# EAGLE design CUSTOMIZEARDUINO (EAGLE 9.6.2)
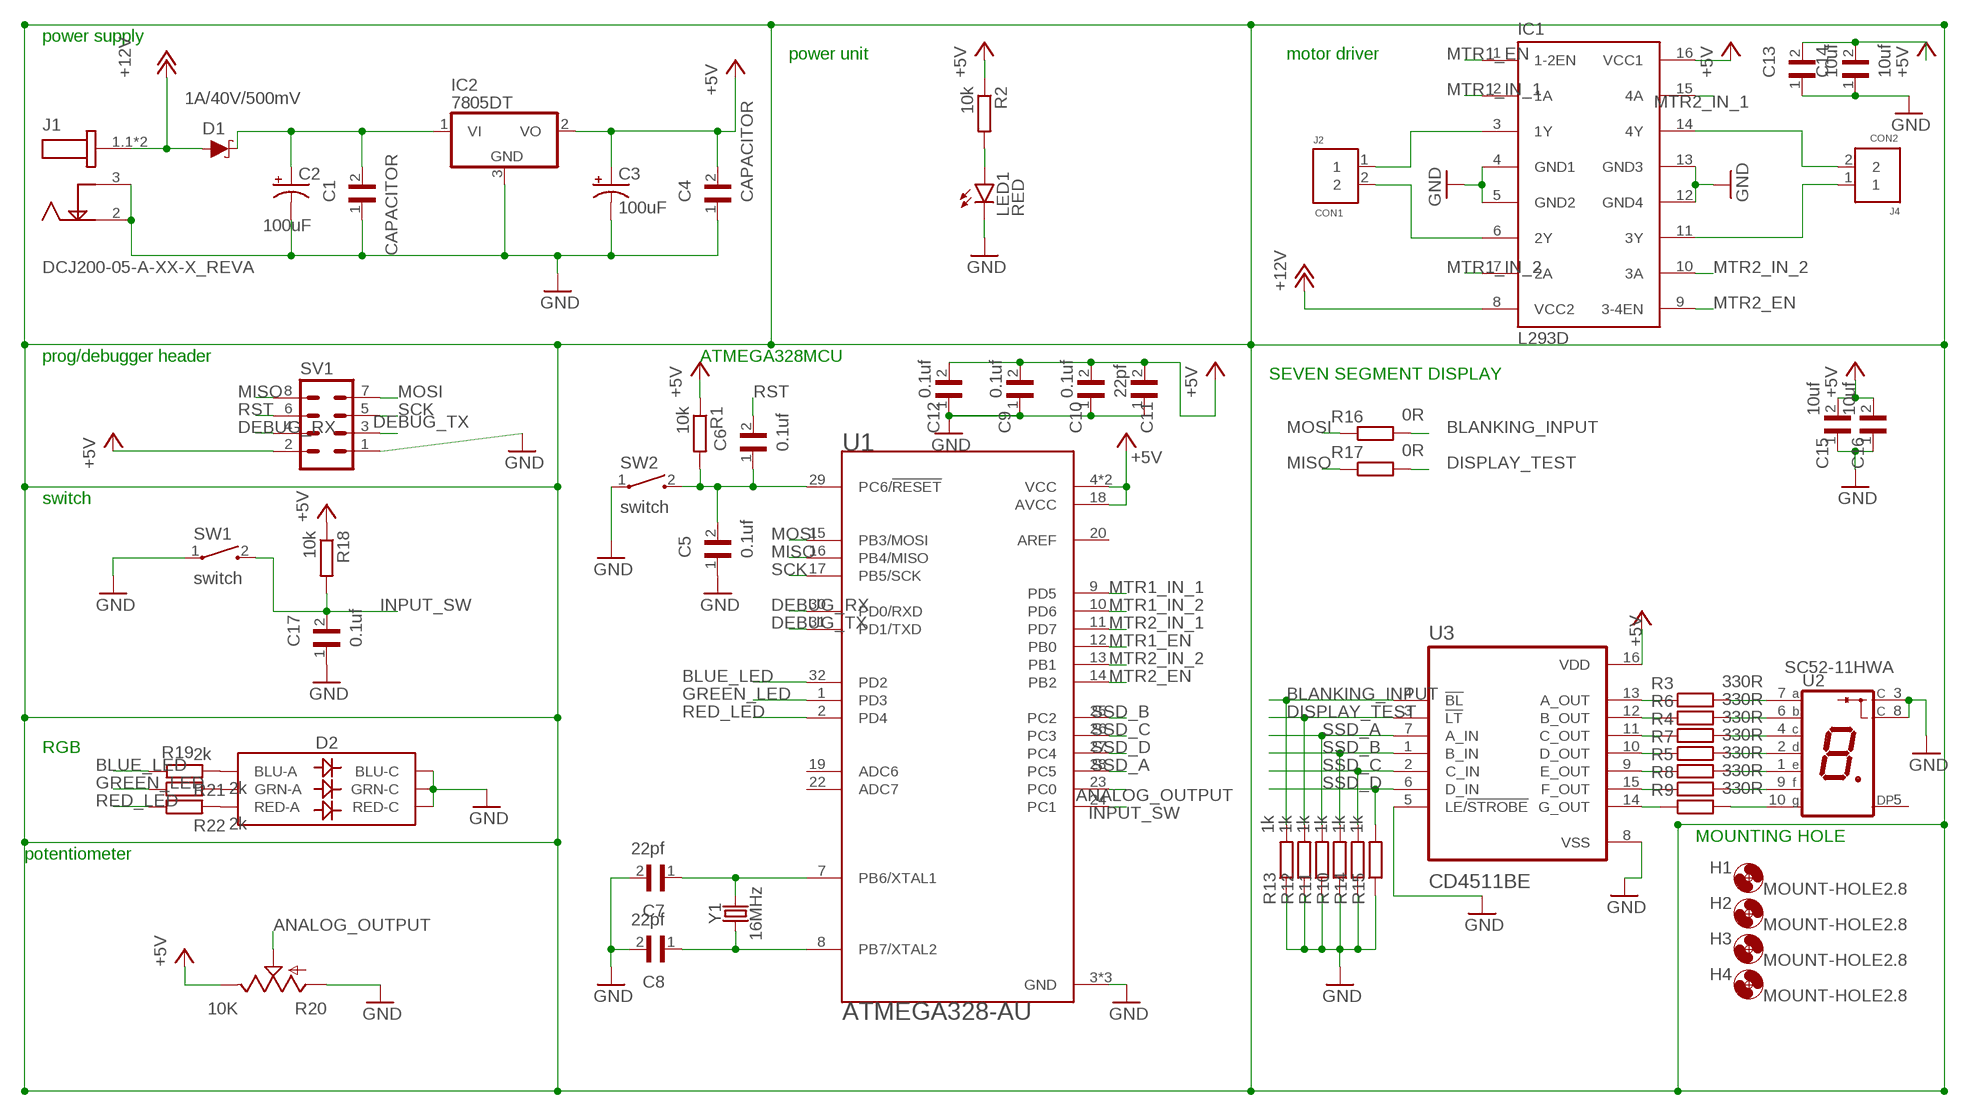
[diagram p0: schematic, sheet 1]

## Parts
C1  CAPACITOR  [C0603]
C2  100uF  100UF-POLAR-RADIAL-2.5MM-25V-20%  [CPOL-RADIAL-2.5MM-6.5MM]
C3  100uF  100UF-POLAR-RADIAL-2.5MM-25V-20%  [CPOL-RADIAL-2.5MM-6.5MM]
C4  CAPACITOR  [C0603]
C5  0.1uf  CAPACITOR  [C0603]
C6  0.1uf  CAPACITOR  [C0603]
C7  22pf  CAPACITOR  [C0603]
C8  22pf  CAPACITOR  [C0603]
C9  0.1uf  CAPACITOR  [C0603]
C10  0.1uf  CAPACITOR  [C0603]
C11  22pf  CAPACITOR  [C0603]
C12  0.1uf  CAPACITOR  [C0603]
C13  10uf  CAPACITOR  [C0603]
C14  10uf  CAPACITOR  [C0603]
C15  10uf  CAPACITOR  [C0603]
C16  10uf  CAPACITOR  [C0603]
C17  0.1uf  CAPACITOR  [C0603]
D1  1A/40V/500mV  DIODE-SCHOTTKY-SS14  [SMA-DIODE]
D2  LED-RGBBRG  [LED-TRICOLOR-5050]
H1  MOUNT-HOLE2.8  [2,8]
H2  MOUNT-HOLE2.8  [2,8]
H3  MOUNT-HOLE2.8  [2,8]
H4  MOUNT-HOLE2.8  [2,8]
IC1  L293D  [DIL16]
IC2  7805DT  [TO252]
J1  DCJ200-05-A-XX-X_REVA  [GCT_DCJ200-05-A-XX-X_REVA]
J2  CON1  282836-2  [CONN_282836-2]
J4  CON2  282836-2  [CONN_282836-2]
LED1  RED  LED  [SMARTLED-TTW]
R1  10k  RESISTOR  [R0603]
R2  10k  RESISTOR  [R0603]
R3  330R  RESISTOR  [R0603]
R4  330R  RESISTOR  [R0603]
R5  330R  RESISTOR  [R0603]
R6  330R  RESISTOR  [R0603]
R7  330R  RESISTOR  [R0603]
R8  330R  RESISTOR  [R0603]
R9  330R  RESISTOR  [R0603]
R10  1k  RESISTOR  [R0603]
R11  1k  RESISTOR  [R0603]
R12  1k  RESISTOR  [R0603]
R13  1k  RESISTOR  [R0603]
R14  1k  RESISTOR  [R0603]
R15  1k  RESISTOR  [R0603]
R16  0R  RESISTOR  [R0603]
R17  0R  RESISTOR  [R0603]
R18  10k  RESISTOR  [R0603]
R19  2k  RESISTOR  [R0603]
R20  10K  TRIM_US-S64W  [S64W]
R21  2k  RESISTOR  [R0603]
R22  2k  RESISTOR  [R0603]
SV1  MA04-2  [MA04-2]
SW1  switch  1437566-3  [SW_1437566-3]
SW2  switch  1437566-3  [SW_1437566-3]
U1  ATMEGA328-AU  [QFP80P900X900X120-32N]
U2  SC52-11HWA  [LED_SC52-11HWA]
U3  CD4511BE  [DIP794W45P254L1969H508Q16]
Y1  16MHz  CRYSTAL-16MHZPTH-HC49US  [HC49US]

## Nets
+5V: C3.1(+) C4.2 C9.2 C10.2 C11.2 C12.2 C13.2 C14.2 C15.2 C16.2 IC1.16(VCC1) IC2.2(VO) R1.1 R2.1 R18.1 R20.E SV1.2 U1.4(VCC) U1.6(VCC) U1.18(AVCC) U3.16(VDD)
+12V: D1.A IC1.8(VCC2) J1.1.1 J1.1.2
ANALOG_OUTPUT: R20.S U1.23(PC0)
BLANKING_INPUT: R13.2 R16.2 U3.4(!BL)
BLUE_LED: D2.6(BLU-A) R19.1 R19.2 U1.32(PD2)
DEBUG_RX: SV1.4 U1.30(PD0/RXD)
DEBUG_TX: SV1.3 U1.31(PD1/TXD)
DISPLAY_TEST: R12.2 R17.2 U3.3(!LT)
GND: C1.1 C2.2(-) C3.2(-) C4.1 C5.1 C7.2 C8.2 C9.1 C10.1 C11.1 C12.1 C13.1 C14.1 C15.1 C16.1 C17.1 D2.1(BLU-C) D2.2(RED-C) D2.3(GRN-C) IC1.4(GND1) IC1.5(GND2) IC1.12(GND4) IC1.13(GND3) IC2.3(GND) J1.2 J1.3 LED1.C@1(C) R10.1 R11.1 R12.1 R13.1 R14.1 R15.1 R20.A SV1.1 SW1.1 SW2.1 U1.3(GND) U1.5(GND) U1.21(GND) U2.3(C) U2.8(C) U3.5(LE/!STROBE) U3.8(VSS)
GREEN_LED: R21.1 U1.1(PD3)
INPUT_SW: C17.2 R18.2 SW1.2 U1.24(PC1)
MISO: R17.1 SV1.8 U1.16(PB4/MISO)
MOSI: R16.1 SV1.7 U1.15(PB3/MOSI)
MTR1_EN: IC1.1(1-2EN) U1.12(PB0)
MTR1_IN_1: IC1.2(1A) U1.9(PD5)
MTR1_IN_2: IC1.7(2A) U1.10(PD6)
MTR2_EN: IC1.9(3-4EN) U1.14(PB2)
MTR2_IN_1: IC1.15(4A) U1.11(PD7)
MTR2_IN_2: IC1.10(3A) U1.13(PB1)
N$2: C1.2 C2.1(+) D1.C IC2.1(VI)
N$3: C5.2 C6.1 R1.2 SW2.2 U1.29(PC6/!RESET)
N$4: C7.1 U1.7(PB6/XTAL1) Y1.2
N$5: C8.1 U1.8(PB7/XTAL2) Y1.1
N$6: LED1.A@1(A) R2.2
N$7: R3.1 U3.13(A_OUT)
N$8: R6.1 U3.12(B_OUT)
N$9: R4.1 U3.11(C_OUT)
N$10: R7.1 U3.10(D_OUT)
N$11: IC1.14(4Y) J4.2
N$12: IC1.11(3Y) J4.1
N$13: IC1.3(1Y) J2.1
N$14: IC1.6(2Y) J2.2
N$15: R5.1 U3.9(E_OUT)
N$16: R8.1 U3.15(F_OUT)
N$17: R9.1 U3.14(G_OUT)
N$18: R3.2 U2.7(A)
N$19: R6.2 U2.6(B)
N$20: R4.2 U2.4(C)
N$21: R7.2 U2.2(D)
N$22: R5.2 U2.1(E)
N$23: R8.2 U2.9(F)
N$24: R9.2 U2.10(G)
N$25: D2.4(GRN-A) R21.2
N$26: D2.5(RED-A) R22.2
RED_LED: R22.1 U1.2(PD4)
RST: C6.2 SV1.6
SCK: SV1.5 U1.17(PB5/SCK)
SSD_A: R11.2 U1.28(PC5) U3.7(A_IN)
SSD_B: R10.2 U1.25(PC2) U3.1(B_IN)
SSD_C: R14.2 U1.26(PC3) U3.2(C_IN)
SSD_D: R15.2 U1.27(PC4) U3.6(D_IN)
Unconnected: U1.19(ADC6) U1.20(AREF) U1.22(ADC7) U2.5(DP)

## Notes on the sheet
- power supply
- power unit | motor driver
- prog/debugger header | ATMEGA328MCU
- SEVEN SEGMENT DISPLAY
- switch
- RGB
- MOUNTING HOLE
- potentiometer

## Library data of the parts
C1 C4-C17 = PC_Capacitor_0603:CAPACITOR: CAP CERAMIC, 0.1UF, 50V, X7R, 0603, FULL REEL Check prices <https://pricing.snapeda.com/parts/CGA3E2X7R1H104K080AA/TDK/view-part?ref=eda>; AVAILABILITY: Good; DESCRIPTION: 0.1µF ±10% 50V Ceramic Capacitor X7R 0603 (1608 Metric); MF: TDK; MP: CGA3E2X7R1H104K080AA; PACKAGE: 1608 TDK; PRICE: None; PURCHASE-URL: https://pricing.snapeda.com/search/part/CGA3E2X7R1H104K080AA/?ref=eda
C2 C3 = SparkFun-Capacitors:100UF-POLAR: 100µF polarized capacitors A capacitor is a passive two-terminal electrical component used to store electrical energy temporarily in an electric field.; PROD_ID: CAP-08439
D1 = SparkFun-DiscreteSemi:DIODE-SCHOTTKY: Schottky diode A Schottky diode is a semiconductor diode which has a low forward voltage drop and a very fast switching action.; PROD_ID: DIO-08053
D2 = SparkFun-LED:LED-RGB: LED-RGB 6 pin RGB LED (no common connector) Packages: PLCC-6 LED-TRICOLOR-5050 - No built-in IC SparkFun Products: Digital Sandbox <https://www.sparkfun.com/products/12651> LED- SMD RGB <https://www.sparkfun.com/products/10866>; PROD_ID: DIO-16048
H1-H4 = holes:MOUNT-HOLE: MOUNTING HOLE with drill center marker
IC1 = st-microelectronics:L293D: PUSH-PULL 4 CHANNEL DRIVER; MPN: L293D; OC_FARNELL: 9589619; OC_NEWARK: 56P8249
IC2 = linear:78*: Positive VOLTAGE REGULATOR Source: http://cache.national.com/ds/LM/LM78L05.pdf http://www.fairchildsemi.com/ds/LM/LM7805.pdf
J1 = PC_CON_DC_Power_Jack:DCJ200-05-A-XX-X_REVA: DC Power Jack, SMT, Horizontal, with Locating Pegs, D2.0mm Check prices <https://pricing.snapeda.com/parts/DCJ200-05-A-K1-A/Global%20Connector%20Technology/view-part?ref=eda>; AVAILABILITY: Warning; DESCRIPTION: Power Barrel Connector Jack 2.05mm ID (0.081), 5.50mm OD (0.217) Surface Mount, Right Angle; MF: Global Connector Technology; MP: DCJ200-05-A-K1-A; PACKAGE: None; PRICE: None; PURCHASE-URL: https://pricing.snapeda.com/search/part/DCJ200-05-A-K1-A/?ref=eda
J2 J4 = PC_CON_ScrewTerminal_2P_5mm:282836-2: TERM BLOCK 2POS SIDE ENTRY 5MM Check availability <https://pricing.snapeda.com/parts/282836-2/TE%20Connectivity/view-part?ref=eda>; AVAILABILITY: In Stock; COMMENT: 282836-2; DESCRIPTION: Connector, Terminal Block; Wire Receptacle; 2 Pos.; 16-30 AWG; 0.197 in. CL; Sid; MF: TE Connectivity; MP: 282836-2; PACKAGE: None; PRICE: None; PURCHASE-URL: https://pricing.snapeda.com/search/part/282836-2/?ref=eda
LED1 = led:LED: LED OSRAM: - CHIPLED LG R971, LG N971, LY N971, LG Q971, LY Q971, LO R971, LY R971 LH N974, LH R974 LS Q976, LO Q976, LY Q976 LO Q996 - Hyper CHIPLED LW Q18S LB Q993, LB Q99A, LB R99A - SideLED LS A670, LO A670, LY A670, LG A670, LP A670 LB A673, LV A673, LT A673, LW A673 LH A674 LY A675 LS A676, LA A676, LO A676, LY A676, LW A676 LS A679, LY A679, LG A679 - Hyper Micro SIDELED® LS Y876, LA Y876, LO Y876, LY Y876 LT Y87S - SmartLED LW L88C, LW L88S LB L89C, LB L89S, LG L890 LS L89K, LO L89K, LY L89K LS L896, LA L896, LO L896, LY L896 - TOPLED LS T670, LO T670, LY T670, LG T670, LP T670 LSG T670, LSP T670, LSY T670, LOP T670, LYG T670 LG T671, LOG T671, LSG T671 LB T673, LV T673, LT T673, LW T673 LH T674 LS T676, LA T676, LO T676, LY T676, LB T676, LH T676, LSB T676, LW T676 LB T67C, LV T67C, LT T67C, LS T67K, LO T67K, LY T67K, LW E67C LS E67B, LA E67B, LO E67B, LY E67B, LB E67C, LV E67C, LT E67C LW T67C LS T679, LY T679, LG T679 LS T770, LO T770, LY T770, LG T770, LP T770 LB T773, LV T773, LT T773, LW T773 LH T774 LS E675, LA E675, LY E675, LS T675 LS T776, LA T776, LO T776, LY T776, LB T776 LHGB T686 LT T68C, LB T68C - Hyper Mini TOPLED® LB M676 - Mini TOPLED Santana® LG M470 LS M47K, LO M47K, LY M47K Source: http://www.osram.convergy.de LUXEON: - LUMILED® LXK2-PW12-R00, LXK2-PW12-S00, LXK2-PW14-U00, LXK2-PW14-V00 LXK2-PM12-R00, LXK2-PM12-S00, LXK2-PM14-U00 LXK2-PE12-Q00, LXK2-PE12-R00, LXK2-PE12-S00, LXK2-PE14-T00, LXK2-PE14-U00 LXK2-PB12-K00, LXK2-PB12-L00, LXK2-PB12-M00, LXK2-PB14-N00, LXK2-PB14-P00, LXK2-PB14-Q00 LXK2-PR12-L00, LXK2-PR12-M00, LXK2-PR14-Q00, LXK2-PR14-R00 LXK2-PD12-Q00, LXK2-PD12-R00, LXK2-PD12-S00 LXK2-PH12-R00, LXK2-PH12-S00 LXK2-PL12-P00, LXK2-PL12-Q00, LXK2-PL12-R00 Source: www.luxeon.com KINGBRIGHT: KA-3528ASYC Source: www.kingbright.com
R1-R19 R21 R22 = PC_Resistor_0603:RESISTOR; MF: Yageo; RESISTOR: 0603
R20 = pot:TRIM_US-: POTENTIOMETER
SV1 = con-lstb:MA04-2: PIN HEADER; OC_FARNELL: unknown; OC_NEWARK: unknown
SW1 SW2 = PC_Switch_1437566-3:1437566-3: Switch Tactile OFF (ON) SPST Rectangular Button Gull Wing 0.05A 12VDC SMD Loose Piece Check prices <https://pricing.snapeda.com/parts/1437566-3/TE%20Connectivity/view-part?ref=eda>; AVAILABILITY: Good; COMMENT: 1437566-3; CONFIGURATION_POLE-THROW: Single Pole - Single Throw; CONTACT_CURRENT_RATING: 50 mA; DESCRIPTION: Tactile Switch SPST-NO Top Actuated Surface Mount; MF: TE Connectivity; MP: 1437566-3; PACKAGE: None; PRICE: None
U1 = PC_IC_ATMEGA328-AU:ATMEGA328-AU: ATmega Series 20 MHz 32 KB Flash 2 KB SRAM 8-Bit Microcontroller - TQFP-32 Check prices <https://pricing.snapeda.com/parts/ATMEGA328-AU/Microchip/view-part?ref=eda>; AVAILABILITY: In Stock; DESCRIPTION: AVR AVR® ATmega Microcontroller IC 8-Bit 20MHz 32KB (16K x 16) FLASH 32-TQFP (7x7); MF: Microchip; MP: ATMEGA328-AU; PACKAGE: TQFP-32 Microchip; PRICE: None; PURCHASE-URL: https://pricing.snapeda.com/search/part/ATMEGA328-AU/?ref=eda
U2 = PC_LED-7-SegmentDisplay:SC52-11HWA: Display: LED; single 7-segment; 13.2mm; red; 0.9-2.2mcd Check availability <https://pricing.snapeda.com/parts/SC52-11HWA/Kingbright/view-part?ref=eda>; AVAILABILITY: Not in stock; DESCRIPTION: Display: LED; single 7-segment; 13.2mm; red; 0.9-2.2mcd; MF: Kingbright; MP: SC52-11HWA; PACKAGE: None; PRICE: None
U3 = PC_IC_CD4511BE:CD4511BE: None Check availability <https://pricing.snapeda.com/parts/CD4511BE/Texas%20Instruments/view-part?ref=eda>; AVAILABILITY: In Stock; DESCRIPTION: CMOS BCD-to-7-Segment LED Latch Decoder Drivers 16-PDIP -55 to 125; MF: Texas Instruments; MP: CD4511BE; PACKAGE: PDIP-16 Texas Instruments; PRICE: None; PURCHASE-URL: https://pricing.snapeda.com/search/part/CD4511BE/?ref=eda
Y1 = SparkFun-Clocks:CRYSTAL-16MHZ: 16MHz Crystal Digikey Example <http://www.digikey.com/product-search/en?keywords=535-9122-1-ND> Frequency: 16MHz Frequency Stability: ±50ppm Frequency Tolerance: ±20ppm Load Capacitance: 18pF SparkFun Products: Pro Micro -5V/16MHz <https://www.sparkfun.com/products/12640> SparkFun Serial Enabled LCD Kit <https://www.sparkfun.com/products/10097>; PROD_ID: XTAL-08181; SF_ID: COM-00536

## Board
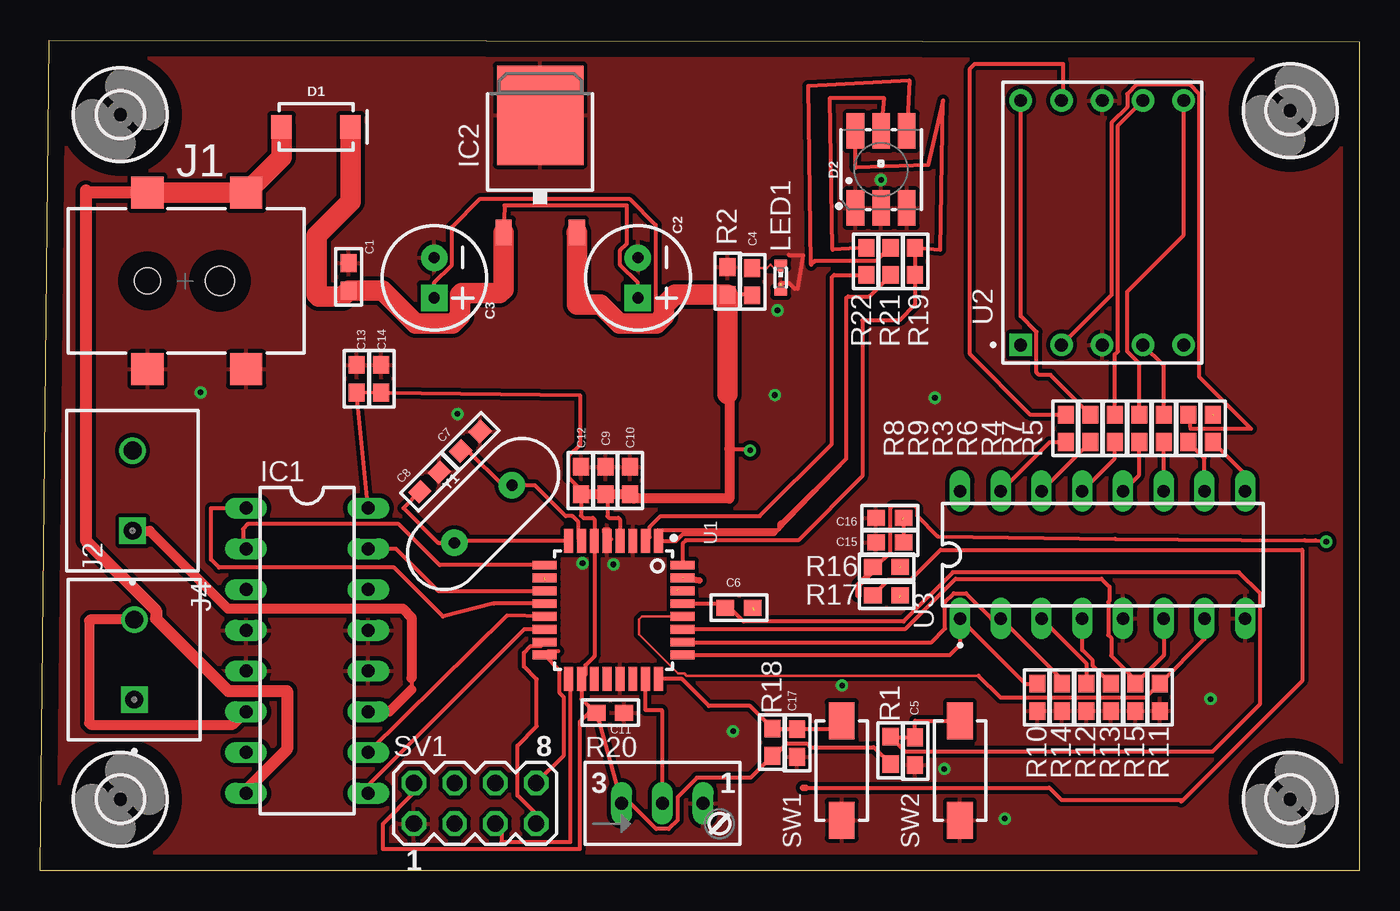
[diagram p1: board, top side]
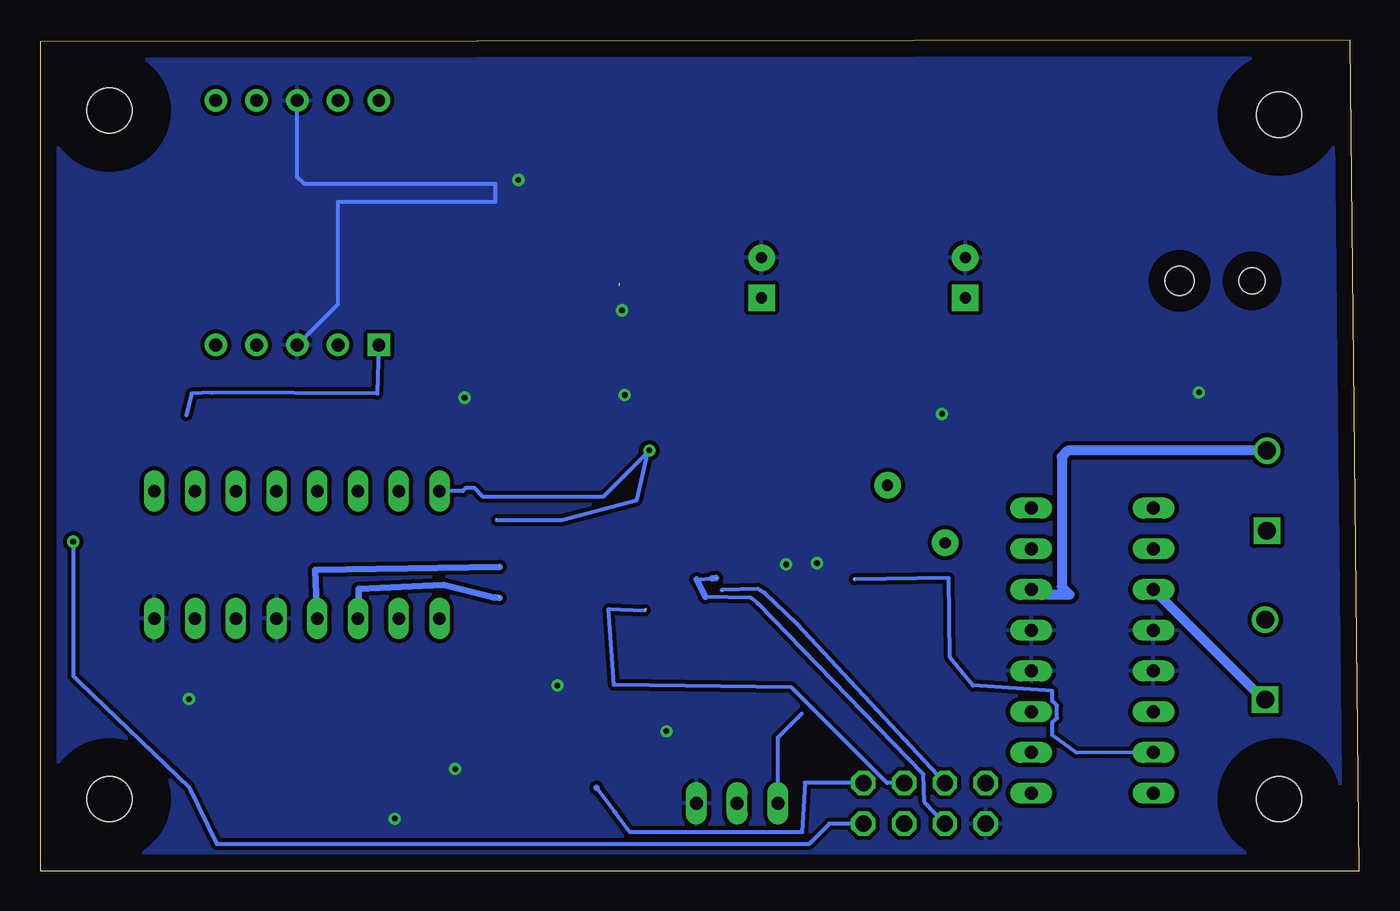
[diagram p2: board, bottom side, seen from below]

Size 82.22 x 51.77 mm. Coordinates in mm from the lower left corner, seen from the top.
Outline: 0.56,51.77 82.22,51.66 82.22,0 0,0 0.56,51.77
Copper layers (1*16): Top 0.035mm / dielectric 1.5mm / Bottom 0.035mm
Design rules "default": minimum track width 6mil, minimum drill 0.35mm, track to track 6mil, track to pad 6mil, pad to pad 6mil, via to via 6mil, smd to smd 6mil, copper to edge 40mil, drill to drill 6mil, minimum pad ring 10mil, minimum via ring 8mil, stop-mask expansion 4mil, vias tented up to drill 0mil, thermal gap 10mil

### Footprints (pad centres in the part's own frame; a part is rotated, then mirrored left to right if it is on the bottom)
C0603 = smd 1.1 x 1: 1 -0.909,0; 2 0.809,0
CPOL-RADIAL-2.5MM-6.5MM = drill 0.7 pad 1.651 square: 1 1.25,0 | drill 0.7 pad 1.651: 2 -1.25,0
SMA-DIODE = smd 1.27 x 1.47: A -2.15,0; C 2.15,0
LED-TRICOLOR-5050 = smd 2.2 x 1.1: 1 -2.4,1.6; 2 -2.4,0; 3 -2.4,-1.6; 4 2.4,-1.6; 5 2.4,0; 6 2.4,1.6
2,8 = hole 2.8: 0,0
DIL16 = drill 0.813 long: 1 -8.89,-3.81; 2 -6.35,-3.81; 3 -3.81,-3.81; 4 -1.27,-3.81; 5 1.27,-3.81; 6 3.81,-3.81; 7 6.35,-3.81; 8 8.89,-3.81; 9 8.89,3.81; 10 6.35,3.81; 11 3.81,3.81; 12 1.27,3.81; 13 -1.27,3.81; 14 -3.81,3.81; 15 -6.35,3.81; 16 -8.89,3.81
TO252 = smd 1 x 1.6: 1 -2.28,-4.8; 2 2.28,-4.8 | smd 5.4 x 6.2: 3 0,2.5
GCT_DCJ200-05-A-XX-X_REVA = smd 2 x 2: 1.1 -5.5,3.8; 1.2 -5.5,-2.35; 2 5.5,-2.35; 3 5.5,3.8 | hole 1.8: 0,2.15 | hole 1.6: 0,-2.35
CONN_282836-2 = drill 1.1 square: 1 -2.5,0 | drill 1.1: 2 2.5,0
SMARTLED-TTW = smd 0.8 x 0.5: A 0,-0.875; C 0,0.875 | smd 0.35 x 0.35: A@1 0,-0.5; C@1 0,0.5
R0603 = smd 1.1 x 1: 1 -0.85,0; 2 0.85,0
S64W = drill 0.813 long: A 2.54,1.27; E -2.54,1.27; S 0,1.27
MA04-2 = drill 1.016 octagon: 1 -3.81,-1.27; 2 -3.81,1.27; 3 -1.27,-1.27; 4 -1.27,1.27; 5 1.27,-1.27; 6 1.27,1.27; 7 3.81,-1.27; 8 3.81,1.27
SW_1437566-3 = smd 2.3 x 1.6: 1 -3.08,0; 2 3.12,0
QFP80P900X900X120-32N = smd 1.5 x 0.55: 1 -4.3,2.8; 2 -4.3,2; 3 -4.3,1.2; 4 -4.3,0.4; 5 -4.3,-0.4; 6 -4.3,-1.2; 7 -4.3,-2; 8 -4.3,-2.8; 17 4.3,-2.8; 18 4.3,-2; 19 4.3,-1.2; 20 4.3,-0.4; 21 4.3,0.4; 22 4.3,1.2; 23 4.3,2; 24 4.3,2.8 | smd 0.55 x 1.5: 9 -2.8,-4.3; 10 -2,-4.3; 11 -1.2,-4.3; 12 -0.4,-4.3; 13 0.4,-4.3; 14 1.2,-4.3; 15 2,-4.3; 16 2.8,-4.3; 25 2.8,4.3; 26 2,4.3; 27 1.2,4.3; 28 0.4,4.3; 29 -0.4,4.3; 30 -1.2,4.3; 31 -2,4.3; 32 -2.8,4.3
LED_SC52-11HWA = drill 0.8 pad 1.4 square: 1 -7.62,5.08 | drill 0.8 pad 1.4: 2 -7.62,2.54; 3 -7.62,0; 4 -7.62,-2.54; 5 -7.62,-5.08; 6 7.62,-5.08; 7 7.62,-2.54; 8 7.62,0; 9 7.62,2.54; 10 7.62,5.08
DIP794W45P254L1969H508Q16 = drill 0.78 pad 1.13 long: 1 -3.97,8.89; 2 -3.97,6.35; 3 -3.97,3.81; 4 -3.97,1.27; 5 -3.97,-1.27; 6 -3.97,-3.81; 7 -3.97,-6.35; 8 -3.97,-8.89; 9 3.97,-8.89; 10 3.97,-6.35; 11 3.97,-3.81; 12 3.97,-1.27; 13 3.97,1.27; 14 3.97,3.81; 15 3.97,6.35; 16 3.97,8.89
HC49US = drill 0.7 pad 1.651: 1 -2.54,0; 2 2.54,0

### Placement (x,y rotation side)
C1  19.23,36.96 270 top
C2  37.26,36.96 270 top
C3  24.56,36.96 270 top
C4  42.85,36.7 270 top
C5  54.53,7.49 90 top
C6  43.61,16.38 0 top
C7  26.85,26.8 45 top
C8  24.31,24.26 45 top
C9  35.23,24.26 270 top
C10  36.75,24.26 270 top
C11  35.48,9.84 180 top
C12  33.71,24.26 270 top
C13  19.74,30.61 270 top
C14  21.26,30.61 270 top
C15  53.01,20.45 0 top
C16  53.01,21.97 0 top
C17  47.17,8 90 top
D1  17.2,46.36 0 top
D2  52.41,43.7 90 top
H1  77.9,47.37 0 top
H2  5,4.45 0 top
H3  77.9,4.45 0 top
H4  5,47.12 0 top
IC1  16.64,13.71 270 top
IC2  31.17,44.58 0 top
J1  9.04,36.75 270 top
J2  5.87,13.15 90 top
J4  5.77,23.68 90 top
LED1  46.15,36.96 180 top
R1  53.01,7.49 90 top
R2  44.37,36.7 90 top
R3  66.98,27.56 90 top
R4  70.03,27.56 90 top
R5  73.08,27.56 90 top
R6  68.5,27.56 90 top
R7  71.55,27.56 90 top
R8  63.93,27.56 90 top
R9  65.46,27.56 90 top
R10  62.15,10.79 90 top
R11  69.77,10.79 90 top
R12  65.2,10.79 90 top
R13  66.73,10.79 90 top
R14  63.68,10.79 90 top
R15  68.25,10.79 90 top
R16  52.76,18.92 0 top
R17  52.76,17.14 0 top
R18  45.64,8 90 top
R19  54.53,37.97 90 top
R20  38.79,2.92 0 top
R21  53.01,37.97 90 top
R22  51.49,37.97 90 top
SV1  27.1,4.19 0 top
SW1  49.96,6.22 90 top
SW2  57.33,6.22 90 top
U1  35.74,16.24 270 top
U2  66.19,40.38 90 top
U3  66.22,19.68 90 top
Y1  27.61,22.22 45 top

### Tracks (layer width: path | path; a pad name or v marks a point on that pad's centre or on a via)
+5V  (via drill 0.35)  (1 unrouted)
  Top 0.254: C4.2 44.33,35.89 R2.1 | C9.2 35.35,23.33 35.35,22.09 35.45,21.99 36.05,21.99 36.14,21.9 U1.4 | 34.6,9.84 C11.2 R20.E 36.8,4.19 38.4,2.59 39.17,2.59 39.73,3.14 39.73,4.58 40.94,5.79 44.28,5.79 R18.1 45.78,7.15 46.55,7.92 47.78,7.92 48.02,7.69 51.96,7.69 R1.1 | 34.6,9.84 33.74,10.7 U1.18 33.98,12.18 33.98,12.8 34.54,13.36 U1.6 34.54,21.9 34.45,21.99 33.85,21.99 33.71,22.13 C12.2 33.71,23.72 32.93,24.5 32.93,25.83 33.63,26.54 33.63,29.64 C14.2 19.74,29.77 | SV1.2 23.29,4.83 21.35,2.89 21.35,1.34 33.65,1.34 33.65,9.29 34.2,9.84 34.6,9.84 | 42.95,26.29 44.15,26.29 v44.25,26.19 | IC1.16 19.74,29.77 | 19.74,29.77 C13.2 | C16.2 54.24,22.16 | C3.1 24.56,36.64 25.67,37.75 25.67,40.11 27.43,41.88 27.44,41.87 36.73,41.87 38.37,40.23 38.37,34.77 38.2,34.6 36.32,34.6 35.63,35.29 33.45,35.29 | C16.2 54.24,22 | C16.2 C15.2
  Top 0.635: 42.85,29.69 42.95,29.59 42.95,26.29 42.95,23.19 37.01,23.19 C10.2 C9.2 C12.2
  Top 1.27: IC2.2 33.45,35.29 34.91,35.29 36.11,34.09 38.41,34.09 38.87,34.55 38.87,35.22 39.55,35.89 C4.2 42.85,29.69
  Bottom 0.254: R20.E 36.25,8.29 34.75,9.79 | v44.25,26.19 44.34,26.1 | 44.34,26.1 47.15,23.29 54.6,23.29 55.16,23.84 55.7,23.84 55.89,23.65 U3.16 | 53.75,21.84 49.73,21.84 45.03,23.1 44.34,26.1
+12V
  Top 0.762: J1.1.2 2.98,42.25 2.85,42.39 2.85,20.59 7.22,16.21 7.22,15.7 11.73,11.19 15.39,11.19 15.39,7.56 12.83,5.01 IC1.8
  Top 1.27: J1.1.2 J1.1.1 15.05,44.46 D1.A
ANALOG_OUTPUT
  Top 0.254: R20.S 38.79,9.95 38.75,9.99 37.75,9.99 37.74,10 U1.23
BLANKING_INPUT  (1 unrouted)
  Top 0.254: R13.2 65.61,12.76 65.61,13.09 64.95,13.75 U3.4
  Bottom 0.406: U3.4 65.07,18.74 53.58,18.91
BLUE_LED
  Top 0.254: R19.1 | R19.1 54.53,35.28 53.55,34.29 51.25,34.29 51.25,24.59 47.25,20.59 40.25,20.59 40.04,20.38 U1.32 | R19.1 R19.2 56.1,38.69 56.27,48 55.34,43.97 50.82,43.8 D2.6
DEBUG_RX  (1 unrouted)
  Top 0.254: U1.30 39.67,17.44
  Bottom 0.254: SV1.4 35.04,15.39 37.07,17.32 37.49,17.57 39.75,17.48
DEBUG_TX  (1 unrouted)
  Top 0.406: U1.31 41.09,18.07
  Bottom 0.254: SV1.3 27.1,4.24 27.18,6 37.49,16.65 37.91,16.98 40.76,17.07 | 41.3,18.15 41.26,18.16 40.33,18.22
  Bottom 0.406: 40.76,17.07 41.3,18.15 | 40.09,18.24 40.33,18.22
DISPLAY_TEST  (1 unrouted)
  Top 0.254: U3.3 65.2,12.92 R12.2
  Bottom 0.406: U3.3 62.38,17.57 57.08,17.81 53.95,17.03 53.78,17.03 53.58,16.98
GND  (via drill 0.35)  (1 unrouted)
  Top 0.152: C4.1 42.94,37.61
  Top 0.254: J1.3 13.1,31.52 | 35.58,20.65 35.27,20.97 | 35.27,20.97 35.15,21.09 35.15,21.29 35.45,21.29 | C11.1 36.14,10.1 | R11.1 69.67,10.04 | 57.3,3.14 57.35,3.19 SW2.1 | 20.3,12.59 IC1.12 | SW1.1 49.55,3.56 | R10.1 62.15,10.04 | 42.94,37.61 42.99,37.61 | 46.65,38.38 46.67,38.36 47.55,38.36 47.21,36.26 47.02,36.26 46.67,36.61 46.15,36.61 | 35.27,20.97 35.29,20.85 U1.5
  Bottom 0.254: U2.3 63.65,35.3 63.65,41.69 53.85,41.69 53.85,42.79 65.75,42.79 66.19,43.23 U2.8
  other vias: 43.19,8.68 45.79,29.64 26.01,28.47 33.8,19.16 52.41,43.05 60.12,3.24 45.96,34.92 55.76,29.47 72.95,10.7 56.35,6.34 49.98,11.53 35.73,19.08 10,29.81
  pour Top (isolate 0.254): -1.82,53.86 84.26,53.78 84.35,-2.63 -2.58,-2.63
  pour Bottom (isolate 0.254): -1.23,54.03 84.51,53.86 84.76,-2.46 -1.57,-2.55
GREEN_LED
  Top 0.254: 53.15,36.98 R21.1 51.68,35.79 50.35,35.79 50.25,35.69 50.25,25.69 | 50.25,25.69 46.25,21.69 46.15,21.69 46.05,21.59 46.05,21.29 45.95,21.19 | 45.95,21.19 38.45,21.19 | U1.1 39.62,20.54 40.08,21 45.75,21 45.95,21.19 | 45.95,21.19 50.25,25.69
INPUT_SW
  Top 0.254: SW1.2 49.43,8.81 C17.2 45.68,8.81 R18.2 44.24,10.25 41.69,10.25 40,11.94 U1.24
MISO  (1 unrouted)
  Top 0.254: SV1.8 32.65,7.2 32.65,10.81 32.38,11.07 32.38,12.49 U1.16 31.68,13.68 32.3,13.68 32.31,13.69 | R17.1 52.9,18.14 54.27,18.14 56.12,19.99 78.65,19.99 78.65,11.81 71.22,4.38 | 71.22,4.38 71.12,4.29 | 71.22,4.38 63.67,4.38 62.89,5.16 47.72,5.16 | 47.55,5.16
  Top 0.406: 47.55,5.16 47.72,5.16
  Bottom 0.254: 34.57,5.49 34.54,5.46 | SV1.8 34.54,5.46 | 34.54,5.46 34.72,2.4 45.45,2.4 46.36,3.61 46.44,3.69 47.55,5.16
  Bottom 0.406: 47.55,5.16
MOSI  (via drill 0.35)
  Top 0.254: SV1.7 30.91,3.53 29.75,4.69 29.75,7.79 30.95,8.99 30.95,11.93 30.16,12.72 30.16,13.58 30.57,13.99 31.19,13.99 U1.15 | R16.1 52.07,18.92 52.99,19.84 52.99,22.59 53.15,22.75 54.48,22.75 54.65,22.59 54.65,22.12 55.93,20.84 66.99,20.67 78.81,20.59 | 78.81,20.59 79.48,20.59 v80.15,20.5 78.81,20.59
  Top 0.406: 51,17.15 51,17.79 51.91,18.7 R16.1
  Bottom 0.254: SV1.7 33.03,2.92 34.3,1.64 71.19,1.64 72.91,5.16 79.73,11.71 80.15,12.12 v80.15,20.5
MTR1_EN
  Top 0.254: IC1.1 10.66,22.6 10.65,22.59 10.65,19.39 11.15,18.89 22.05,18.89 25.1,15.84 28.27,16.65 U1.12
MTR1_IN_1
  Top 0.254: U1.9 24.9,19.04 22.35,21.59 12.95,21.59 12.65,21.29 12.65,20.24 IC1.2
MTR1_IN_2  (1 unrouted)
  Bottom 0.254: IC1.7 17.62,7.34 19.13,8.43 19.13,9.22 18.85,9.51 18.85,10.29 19.13,10.57 19.13,11.2 24.08,11.53 25.5,13.29 25.59,18.24 31.46,18.16
MTR2_EN
  Top 0.254: U1.14 30.17,15.04 20.45,5.32 IC1.9
MTR2_IN_1
  Top 0.254: IC1.15 22.18,20.06 24.8,17.44 U1.11
MTR2_IN_2
  Top 0.254: U1.13 29.11,15.89 IC1.10
  Bottom 0.254: IC1.10 20.85,7.36
N$2
  Top 0.254: C2.1 37.26,36.64 36.16,37.75 36.16,38.67 36.57,39.08 36.57,41.46 28.94,41.46 IC2.1
  Top 1.27: D1.C 19.35,41.69 17.25,39.59 17.25,35.89 17.35,35.79 18.87,35.79 C1.2 21.36,36.15 23.41,34.09 25.71,34.09 26.17,34.55 26.17,35.89 | 26.17,35.89 26.55,35.89 | 26.17,35.89 26.27,35.99 28.65,35.99 28.89,36.23 IC2.1
N$3
  Top 0.254: U1.29 42.45,16.64 42.57,16.51 | 42.57,16.51 C6.1 | SW2.2 54.53,9.34 C5.2 53.05,8.3 R1.2 53.94,7.42 73.05,7.42 76.03,10.4 76.03,17.28 74.72,18.59 56.88,18.59 53.8,15.52 43.84,15.52 42.84,16.51 42.57,16.51
N$4
  Top 0.254: U1.7 33.55,20.73 33.55,21.71 33.17,22.09 32.75,22.09 30.82,24.02 Y1.2 28.82,24.02 26.68,26.15 C7.1
N$5
  Top 0.254: U1.8 25.92,20.54 Y1.1 24.81,20.43 22.65,22.59 22.65,22.6 C8.1
N$6
  Top 0.152: R2.2 45.31,37.55 45.52,37.77 45.84,37.46 LED1.A@1
  Top 0.254: R2.2 44.61,37.55
N$7
  Top 0.254: U3.13 66.98,25.69 R3.1
N$8
  Top 0.254: U3.12 68.5,24.67 R6.1
N$9
  Top 0.254: U3.11 R4.1
N$10
  Top 0.254: U3.10 72.57,25.69 R7.1
N$11
  Bottom 0.635: J4.2 18.16,26.18 18.55,25.79 18.55,17.69 18.05,17.19 20.12,17.19 IC1.14
N$12
  Top 0.254: 23.15,11.99 23.15,11.29
  Top 0.635: J4.1 6.84,21.18 11.7,16.33 22.61,16.33 23.15,15.79 23.15,11.99 | IC1.11 21.76,9.9 23.15,11.29
N$13
  Bottom 0.254: 5.96,10.65 J2.1
  Bottom 0.635: IC1.3 5.96,10.65
N$14
  Top 0.254: 3.11,15.65 3.05,15.59 | 3.05,9.19 3.15,9.09
  Top 0.635: J2.2 3.11,15.65 | 3.05,15.59 3.05,9.19 | 3.15,9.09 12.02,9.09 IC1.6
N$15
  Top 0.254: U3.9 75.11,24.68 R5.1
N$16
  Top 0.254: U3.15 62.92,26.71 R8.1
N$17
  Top 0.254: U3.14 R9.1
N$18
  Top 0.254: R3.2 66.98,32.16 67.17,32.36 67.17,46.44 U2.7
N$19
  Top 0.254: R6.2 68.5,31.6 67.75,32.36 67.75,36.09 71.27,39.61 U2.6
N$20
  Top 0.254: R4.2 70.03,31.46 U2.4
N$21
  Top 0.254: R7.2 71.69,27.54 75.46,27.54 72.25,30.75 72.25,48.41 71.68,48.98 68.33,48.98 67.75,48.41 67.75,47.6 66.76,46.61 66.76,35.87 U2.2
N$22  (1 unrouted)
  Bottom 0.254: U2.1 61.21,29.72 71.52,29.8 | 71.52,29.8 71.52,29.79 | 71.52,29.8 72.78,29.72 73.11,28.38
N$23
  Top 0.254: R8.2 61.73,28.41 57.95,32.19 57.95,49.99 58.25,50.29 63.75,50.29 63.75,48.1 U2.9
N$24
  Top 0.254: R9.2 62.98,30.89 62.25,30.89 62.09,31.05 62.09,33.58 61.11,34.56 U2.10
N$25
  Top 0.254: R21.2 52.93,38.82 52.1,37.99 48.28,37.99 48.05,37.77 47.88,48.92 54.17,49.25 D2.4
N$26
  Top 0.254: R22.2 49.39,38.69 49.22,48.16 52.58,48.16 D2.5
RED_LED
  Top 0.254: 37.85,20.65 U1.2 37.98,20.78 37.98,21.4 38.67,22.09 44.85,22.09 49.35,26.59 49.35,36.99 49.48,37.12 R22.1 51.75,36.86
RST  (1 unrouted)
  Bottom 0.254: SV1.6 29.44,5.46 35.39,11.41 46.46,11.58 46.79,16.3 44.53,16.23
SCK
  Top 0.254: SV1.5 28.75,2.54 28.75,1.79 33.05,1.79 33.05,7.02 33.05,7.03 33.05,11.82 U1.17
SSD_A
  Top 0.152: U1.28 37.52,15.84 37.32,15.64 37.32,14.72 39.75,12.29 40.15,12.29 40.29,12.15 41.51,12.15 41.56,12.15 58.49,12.15
  Top 0.254: U3.7 72.57,14.44 R11.2 68.92,10.79 59.85,10.79 58.49,12.15
SSD_B
  Top 0.254: U3.1 57.35,15.69 | 57.35,15.69 61.4,11.64 R10.2 | U1.25 56.7,13.44 57.35,14.09 57.35,15.69
SSD_C
  Top 0.254: R14.2 63.68,11.9 U3.2 59.28,15.71 57.71,17.28 56.95,17.28 56.4,16.74 56.4,15.09 55.55,14.24 U1.26
SSD_D
  Top 0.254: U3.6 70.03,13.42 68.37,11.77 | 68.37,11.77 R15.2 | 68.37,11.77 66.75,13.39 66.75,14.5 66.56,14.69 66.56,16.74 66.65,16.82 66.65,17.69 66.15,18.19 57.05,18.19 53.9,15.04 U1.27
(copper drawn outside any net)
  shapes: Top area x2

### Text on the board
_tplace: 8 | 3 | 1 | 1